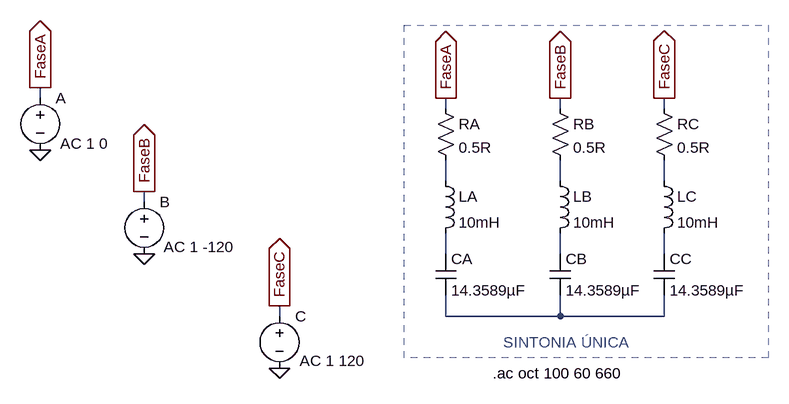
[diagram p0: schematic HF_SintoniaUnica_420Hz.asc]
HF_SintoniaUnica_420Hz.asc, the LTspice schematic file:
Version 4
SHEET 1 1632 680
WIRE -480 -16 -480 -32
WIRE 144 0 144 -16
WIRE 320 0 320 -16
WIRE 480 0 480 -16
WIRE 144 112 144 80
WIRE 320 112 320 80
WIRE 480 112 480 80
WIRE -320 144 -320 128
WIRE 144 224 144 192
WIRE 320 224 320 192
WIRE 480 224 480 192
WIRE -112 320 -112 304
WIRE 144 320 144 288
WIRE 320 320 320 288
WIRE 320 320 144 320
WIRE 480 320 480 288
WIRE 480 320 320 320
FLAG -480 64 0
FLAG -320 224 0
FLAG -112 400 0
FLAG -480 -32 FaseA
IOPIN -480 -32 Out
FLAG 144 -16 FaseA
IOPIN 144 -16 Out
FLAG 320 -16 FaseB
IOPIN 320 -16 Out
FLAG 480 -16 FaseC
IOPIN 480 -16 Out
FLAG -320 128 FaseB
IOPIN -320 128 Out
FLAG -112 304 FaseC
IOPIN -112 304 Out
SYMBOL voltage -480 -32 R0
WINDOW 3 31 86 Left 2
WINDOW 123 31 86 Left 2
WINDOW 39 0 0 Left 0
SYMATTR Value ""
SYMATTR Value2 AC 1 0
SYMATTR InstName A
SYMBOL res 128 -16 R0
SYMATTR InstName RA
SYMATTR Value 0.5R
SYMBOL ind 128 96 R0
SYMATTR InstName LA
SYMATTR Value 10mH
SYMBOL cap 128 224 R0
SYMATTR InstName CA
SYMATTR Value 14.3589µF
SYMBOL res 304 -16 R0
SYMATTR InstName RB
SYMATTR Value 0.5R
SYMBOL ind 304 96 R0
SYMATTR InstName LB
SYMATTR Value 10mH
SYMBOL cap 304 224 R0
SYMATTR InstName CB
SYMATTR Value 14.3589µF
SYMBOL res 464 -16 R0
SYMATTR InstName RC
SYMATTR Value 0.5R
SYMBOL ind 464 96 R0
SYMATTR InstName LC
SYMATTR Value 10mH
SYMBOL cap 464 224 R0
SYMATTR InstName CC
SYMATTR Value 14.3589µF
SYMBOL voltage -320 128 R0
WINDOW 123 30 85 Left 2
WINDOW 39 0 0 Left 0
WINDOW 3 29 90 Left 2
SYMATTR Value2 AC 1 -120
SYMATTR Value ""
SYMATTR InstName B
SYMBOL voltage -112 304 R0
WINDOW 123 31 85 Left 2
WINDOW 39 0 0 Left 0
WINDOW 3 27 84 Left 2
SYMATTR Value2 AC 1 120
SYMATTR Value ""
SYMATTR InstName C
TEXT 216 408 Left 2 !.ac oct 100 60 660
TEXT 232 360 Left 2 ;SINTONIA ÚNICA
RECTANGLE Normal 640 384 80 -128 2

The netlist it stands for:
* HF_SintoniaUnica_420Hz.asc
V§A FaseA 0 AC 1 0
RA FaseA N001 0.5R
LA N001 N004 10mH
CA N004 N007 14.3589µF
RB FaseB N002 0.5R
LB N002 N005 10mH
CB N005 N007 14.3589µF
RC FaseC N003 0.5R
LC N003 N006 10mH
CC N006 N007 14.3589µF
V§B FaseB 0 AC 1 -120
V§C FaseC 0 AC 1 120
.ac oct 100 60 660
* SINTONIA ÚNICA
.backanno
.end